# EAGLE schematic Intento de pcb (EAGLE 9.6.2)
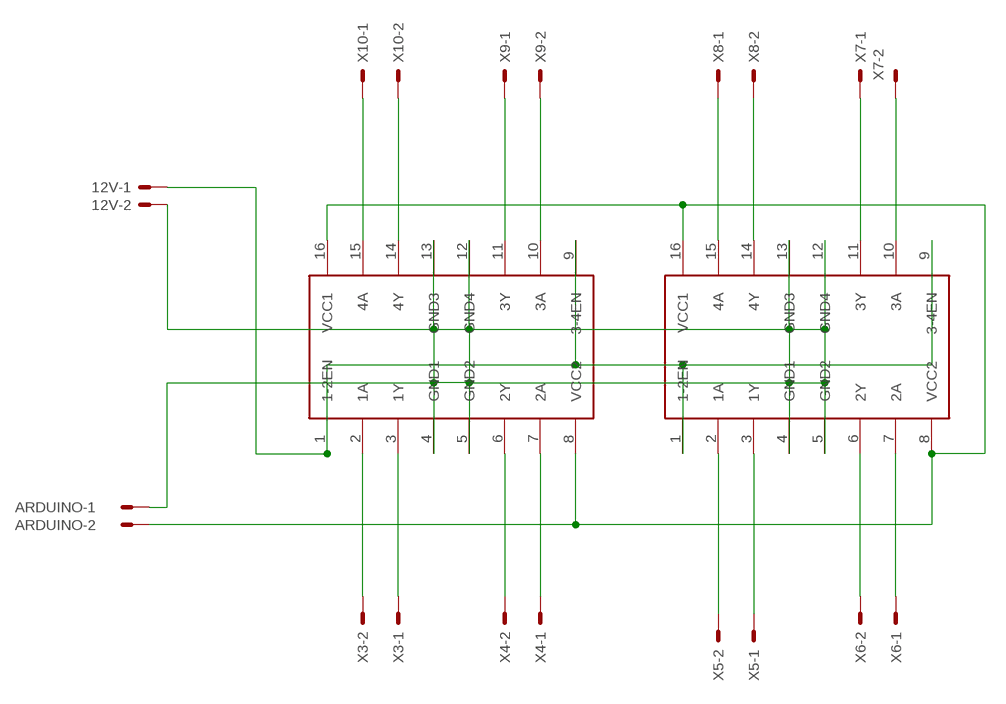
[diagram p0: schematic, sheet 1]

## Parts
12V  22-23-2021  [22-23-2021]
ARDUINO  22-23-2021  [22-23-2021]
IC1  L293D  [DIL16]
IC2  L293D  [DIL16]
X3  22-23-2021  [22-23-2021]
X4  22-23-2021  [22-23-2021]
X5  22-23-2021  [22-23-2021]
X6  22-23-2021  [22-23-2021]
X7  22-23-2021  [22-23-2021]
X8  22-23-2021  [22-23-2021]
X9  22-23-2021  [22-23-2021]
X10  22-23-2021  [22-23-2021]

## Nets
N$1: 12V.2 ARDUINO.1 IC1.4(GND1) IC1.5(GND2) IC1.12(GND4) IC1.13(GND3) IC2.4(GND1) IC2.5(GND2) IC2.12(GND4) IC2.13(GND3)
N$3: IC2.15(4A) X8.1
N$4: IC2.14(4Y) X8.2
N$5: IC2.11(3Y) X7.1
N$6: IC2.10(3A) X7.2
N$7: IC2.7(2A) X6.1
N$8: IC2.6(2Y) X6.2
N$9: IC2.3(1Y) X5.1
N$10: IC2.2(1A) X5.2
N$11: IC1.7(2A) X4.1
N$12: IC1.6(2Y) X4.2
N$13: IC1.3(1Y) X3.1
N$14: IC1.2(1A) X3.2
N$15: IC1.15(4A) X10.1
N$16: IC1.14(4Y) X10.2
N$17: IC1.11(3Y) X9.1
N$18: IC1.10(3A) X9.2
N$19: ARDUINO.2 IC1.8(VCC2) IC1.16(VCC1) IC2.8(VCC2) IC2.16(VCC1)
N$20: 12V.1 IC1.1(1-2EN) IC1.9(3-4EN) IC2.1(1-2EN) IC2.9(3-4EN)

## Library data of the parts
12V ARDUINO X3-X10 = con-molex:22-23-2021: .100" (2.54mm) Center Header - 2 Pin; MF: MOLEX; MPN: 22-23-2021; OC_FARNELL: 1462926; OC_NEWARK: 25C3832
IC1 IC2 = st-microelectronics:L293D: PUSH-PULL 4 CHANNEL DRIVER; MPN: L293D; OC_FARNELL: 9589619; OC_NEWARK: 56P8249